# Altium schematic sheet 低频超声第四版.SchDoc
size A1
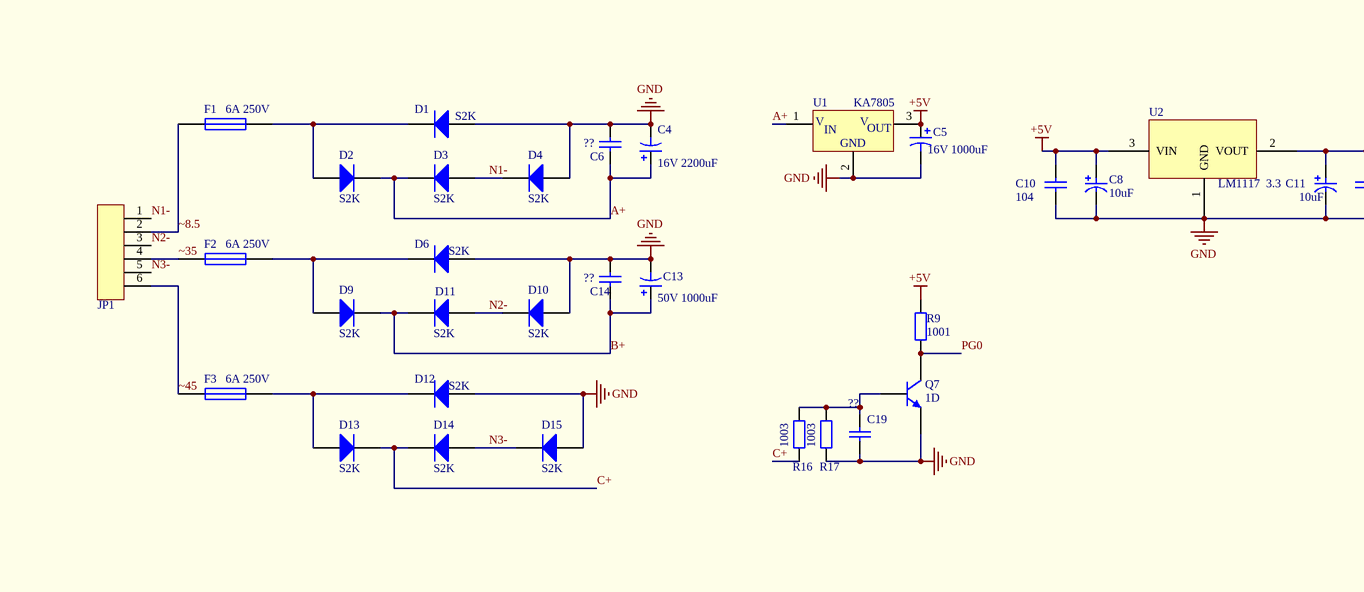
[diagram p0: 低频超声第四版.SchDoc, top left]
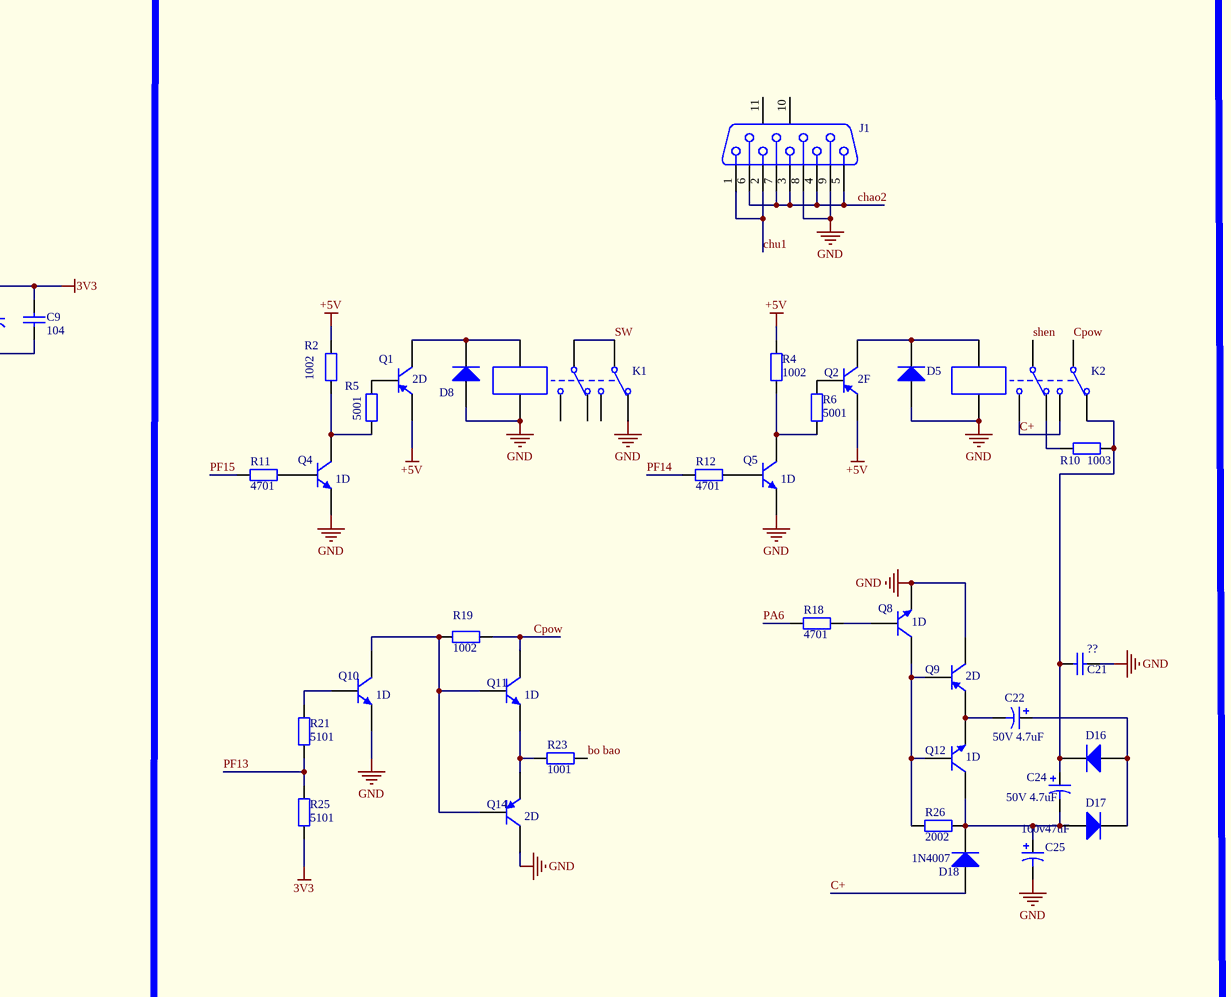
[diagram p1: 低频超声第四版.SchDoc, top middle]
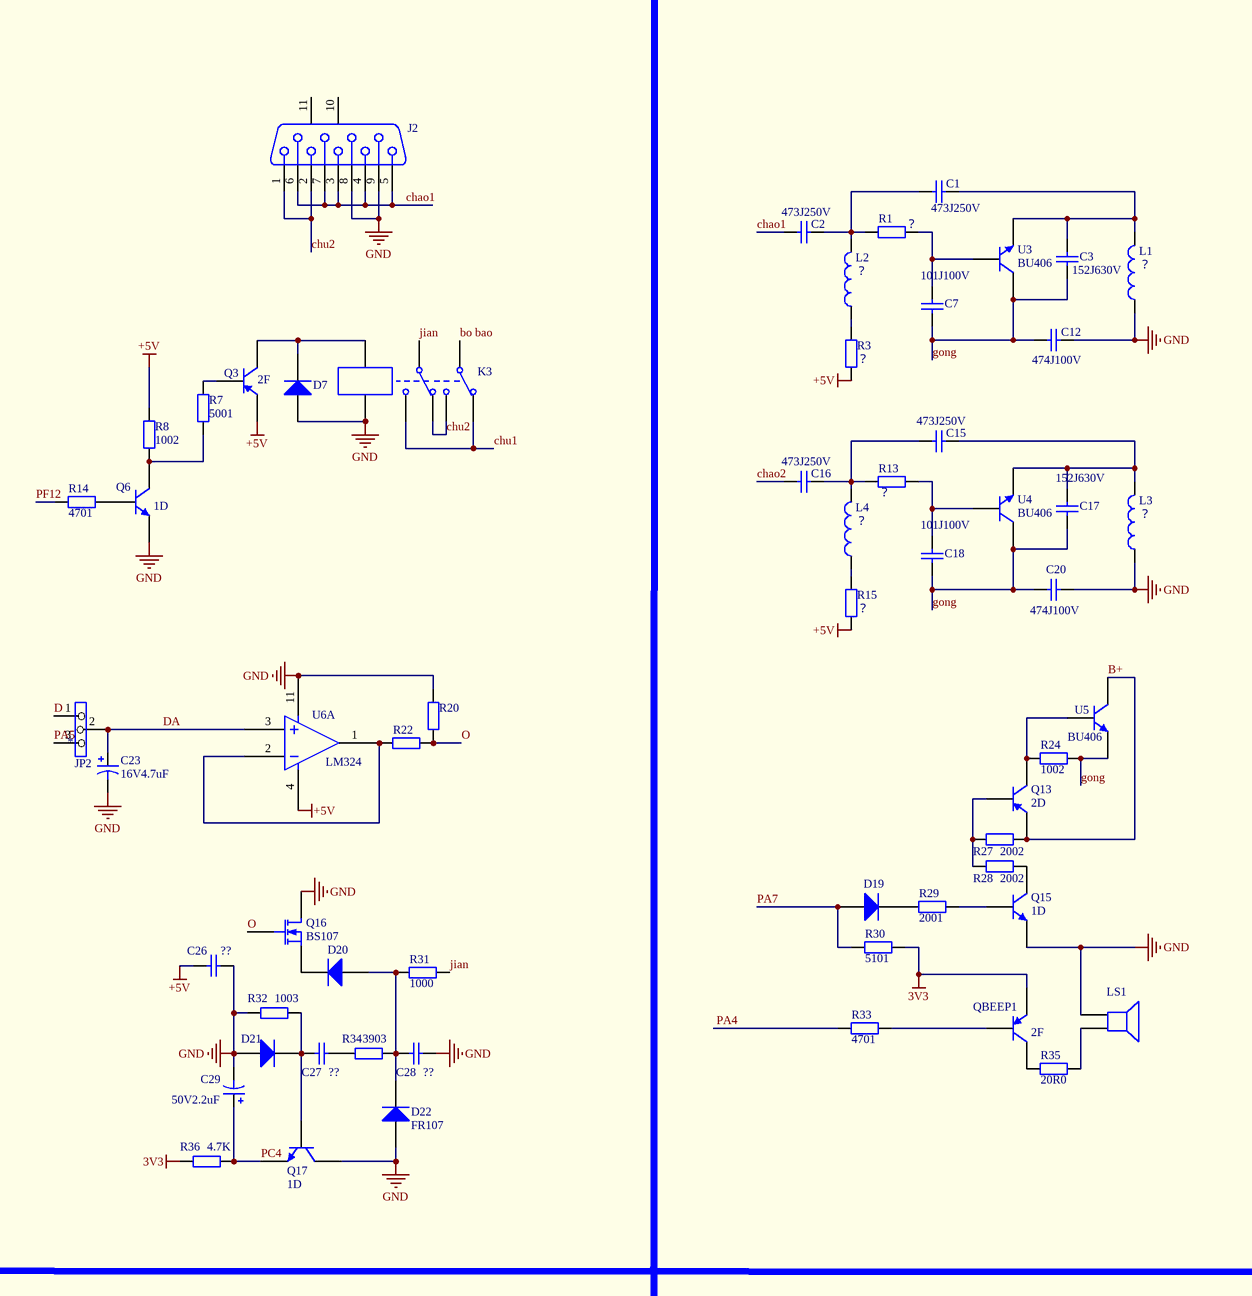
[diagram p2: 低频超声第四版.SchDoc, top right]
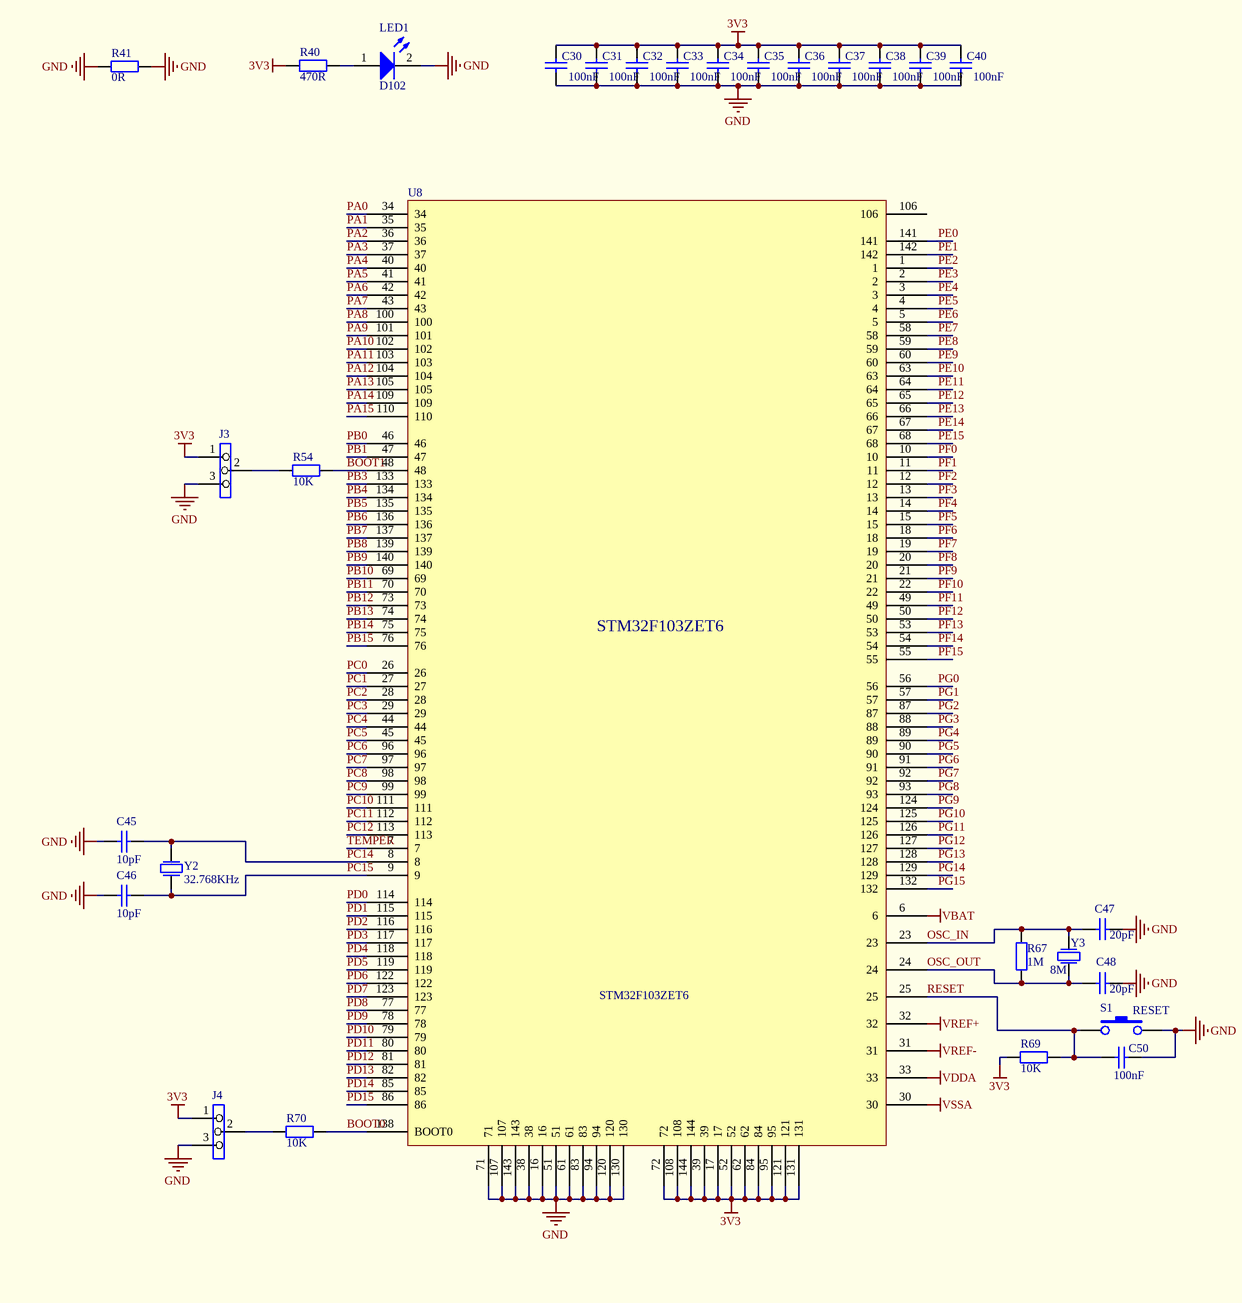
[diagram p3: 低频超声第四版.SchDoc, bottom left]
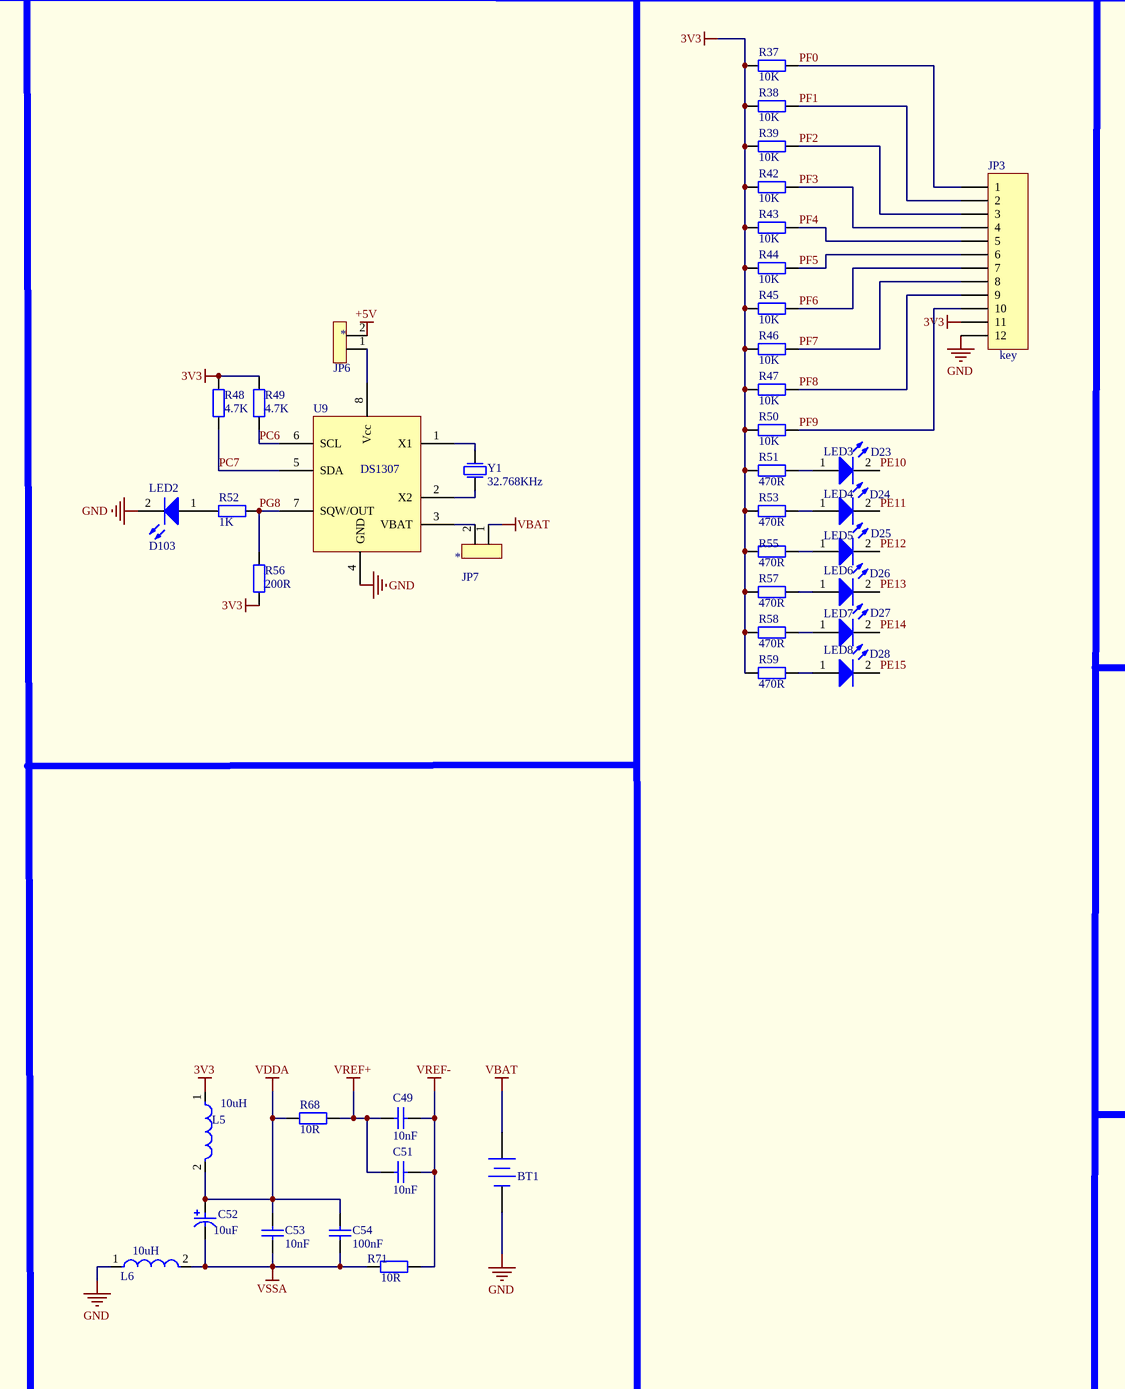
[diagram p4: 低频超声第四版.SchDoc, bottom middle]
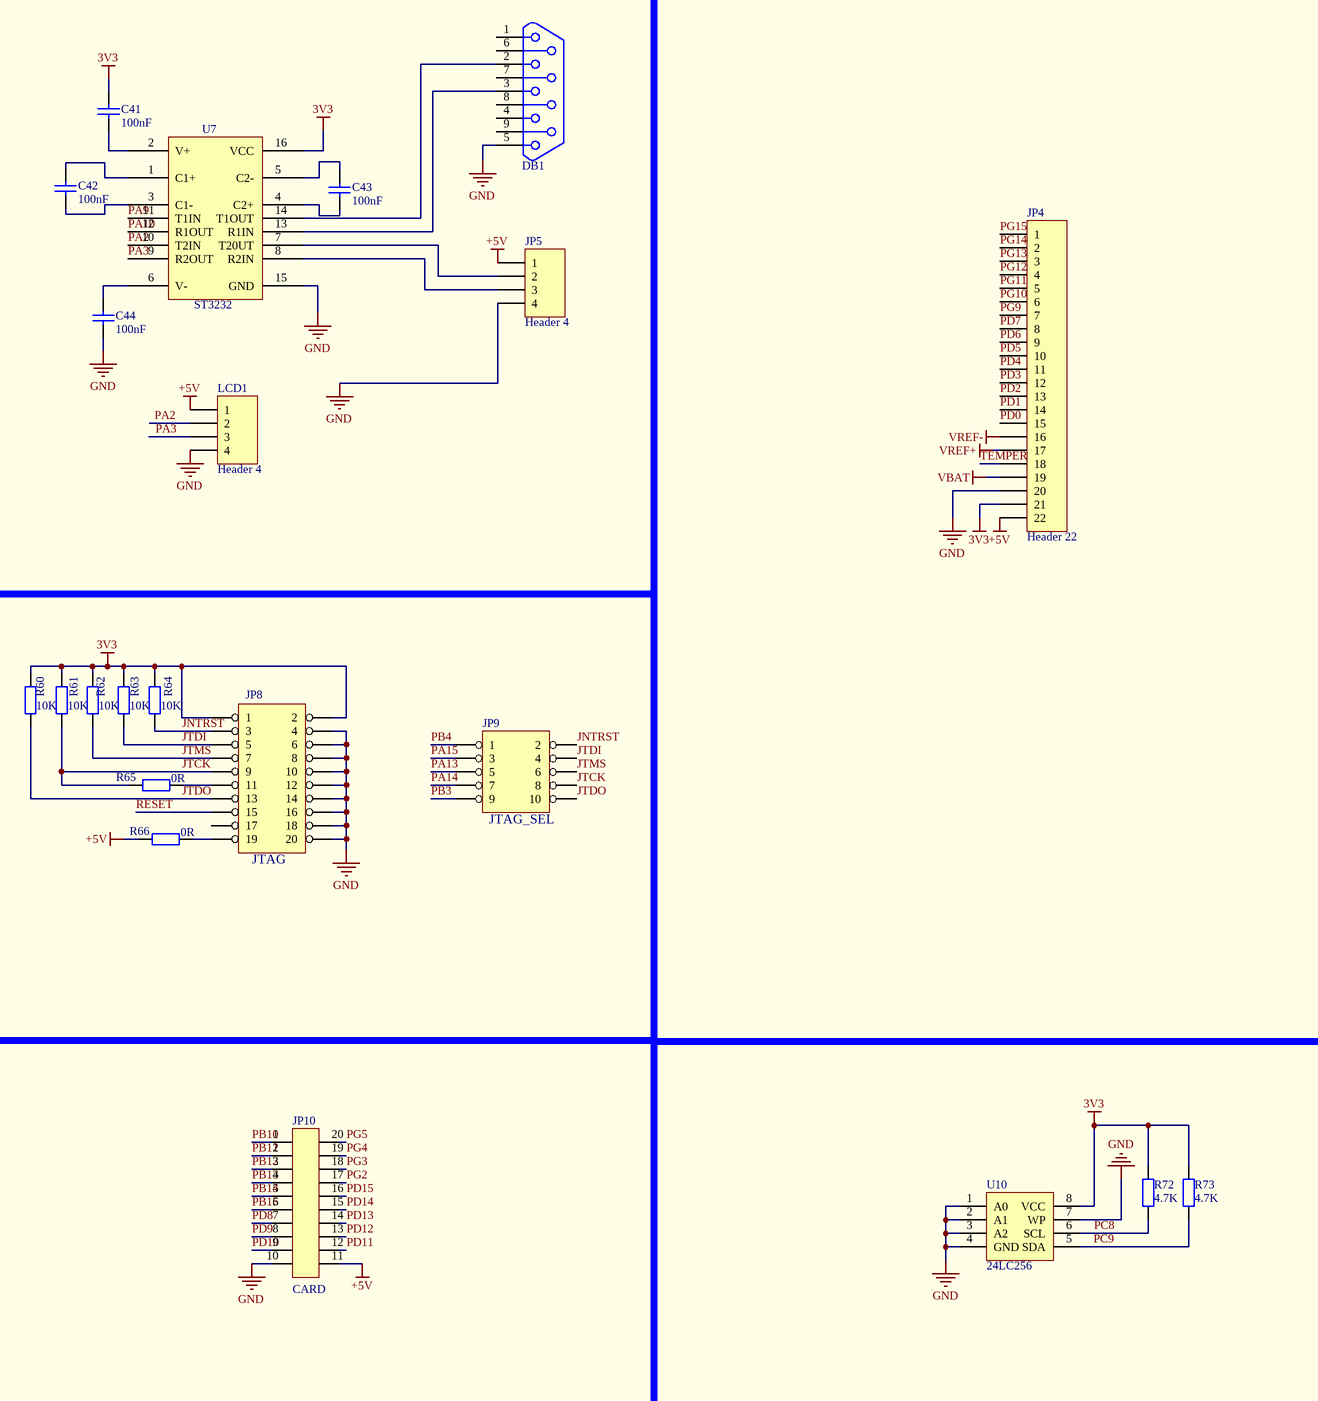
[diagram p5: 低频超声第四版.SchDoc, bottom right]

## Parts
BT1  BATTERY  [BAT]  (value not drawn)
C1  473J250V  [电容1]
C2  473J250V  [电容1]
C3  152J630V  [电容1]
C4  16V 2200uF  [钽电容1]
C5  16V 1000uF  [钽电容1]
C6  ??  [0805C]
C7  101J100V  [电容2]
C8  10uF  [钽电容1]
C9  104  [0805C]
C10  104  [0805C]
C11  10uF  [钽电容2]
C12  474J100V  [电容1]
C13  50V 1000uF  [钽电容1]
C14  ??  [0805C]
C15  473J250V  [电容1]
C16  473J250V  [电容1]
C17  152J630V  [电容1]
C18  101J100V  [电容2]
C19  ??  [0805C]
C20  474J100V  [电容1]
C21  ??  [电容2]
C22  50V 4.7uF  [钽电容1]
C23  16V4.7uF  [钽电容2]
C24  50V 4.7uF  [钽电容1]
C25  160v47uF  [钽电容2]
C26  ??  [0805C]
C27  ??  [0805C]
C28  ??  [0805C]
C29  50V2.2uF  [钽电容2]
C30  100nF  [0805C]
C31  100nF  [0805C]
C32  100nF  [0805C]
C33  100nF  [0805C]
C34  100nF  [0805C]
C35  100nF  [0805C]
C36  100nF  [0805C]
C37  100nF  [0805C]
C38  100nF  [0805C]
C39  100nF  [0805C]
C40  100nF  [0805C]
C41  100nF  [0805C]
C42  100nF  [0805C]
C43  100nF  [0805C]
C44  100nF  [0805C]
C45  10pF  [0805C]
C46  10pF  [0805C]
C47  20pF  [0805C]
C48  20pF  [0805C]
C49  10nF  [0805C]
C50  100nF  [0805C]
C51  10nF  [0805C]
C52  10uF  [钽电容2]
C53  10nF  [0805C]
C54  100nF  [0805C]
D1  S2K  [肖特基]
D2  S2K  [肖特基]
D3  S2K  [肖特基]
D4  S2K  [肖特基]
D5  Diode  [Diode]  (value not drawn)
D6  S2K  [肖特基]
D7  Diode  [Diode]  (value not drawn)
D8  Diode  [Diode]  (value not drawn)
D9  S2K  [肖特基]
D10  S2K  [肖特基]
D11  S2K  [肖特基]
D12  S2K  [肖特基]
D13  S2K  [肖特基]
D14  S2K  [肖特基]
D15  S2K  [肖特基]
D16  Diode  [Diode]  (value not drawn)
D17  Diode  [Diode]  (value not drawn)
D18  1N4007  [1N4007]
D19  Diode  [Diode]  (value not drawn)
D20  Diode  [Diode]  (value not drawn)
D21  Diode  [Diode]  (value not drawn)
D22  FR107  [1N4007]
D23  LED3  [LED]
D24  LED4  [LED]
D25  LED5  [LED]
D26  LED6  [LED]
D27  LED7  [LED]
D28  LED8  [LED]
DB1  (no value)  [串口公头]
F1  6A 250V  [保险]
F2  6A 250V  [保险]
F3  6A 250V  [保险]
J1  D Connector 9  [串口母头]  (value not drawn)
J2  D Connector 9  [串口母头]  (value not drawn)
J3  *  [选择跳线]  (value not drawn)
J4  *  [选择跳线]  (value not drawn)
JP1  6 PIN  [6 PIN]  (value not drawn)
JP2  *  [选择跳线]
JP3  key  [HDR1X12]
JP4  Header 22  [HDR1X22]
JP5  Header 4  [HDR1X4]
JP6  *  [单排插针2]
JP7  *  [单排插针2]
JP8  JTAG  [JTAG]  (value not drawn)
JP9  5*2  [5*2]  (value not drawn)
JP10  CARD  [双排插针10x2]
K1  Relay-DPDT  [DIP-P8]  (value not drawn)
K2  Relay-DPDT  [DIP-P8]  (value not drawn)
K3  Relay-DPDT  [DIP-P8]  (value not drawn)
L1  value ？  [电感]  (hidden comment: Inductor)
L2  value ？  [插阻2]  (hidden comment: Inductor)
L3  value ？  [电感]  (hidden comment: Inductor)
L4  value ？  [插阻2]  (hidden comment: Inductor)
L5  10uH  [0805R]
L6  10uH  [0805R]
LCD1  Header 4  [HDR1X4]
LED1  D102  [LED]
LED2  D103  [LED]
LS1  Speaker  [BEEP]  (value not drawn)
Q1  2D  [SOT23]
Q2  2F  [SOT23]
Q3  2F  [SOT23]
Q4  1D  [SOT23]
Q5  1D  [SOT23]
Q6  1D  [SOT23]
Q7  1D  [SOT23]
Q8  1D  [SOT23]
Q9  2D  [SOT23]
Q10  1D  [SOT23]
Q11  1D  [SOT23]
Q12  1D  [SOT23]
Q13  2D  [SOT23]
Q14  2D  [SOT23]
Q15  1D  [SOT23]
Q16  BS107  [E3]
Q17  1D  [TO-92A]
QBEEP1  2F  [SOT23]
R1  value ？  [插阻2]  (hidden comment: Res2)
R2  value 1002  [0805R]  (hidden comment: Res2)
R3  value ？  [插阻1]  (hidden comment: Res2)
R4  value 1002  [0805R]  (hidden comment: Res2)
R5  value 5001  [0805R]  (hidden comment: Res2)
R6  value 5001  [0805R]  (hidden comment: Res2)
R7  value 5001  [0805R]  (hidden comment: Res2)
R8  value 1002  [0805R]  (hidden comment: Res2)
R9  value 1001  [0805R]  (hidden comment: Res2)
R10  value 1003  [0805R]  (hidden comment: Res2)
R11  value 4701  [0805R]  (hidden comment: Res2)
R12  value 4701  [0805R]  (hidden comment: Res2)
R13  value ？  [插阻2]  (hidden comment: Res2)
R14  value 4701  [0805R]  (hidden comment: Res2)
R15  value ？  [插阻1]  (hidden comment: Res2)
R16  value 1003  [0805R]  (hidden comment: Res2)
R17  value 1003  [0805R]  (hidden comment: Res2)
R18  value 4701  [0805R]  (hidden comment: Res2)
R19  value 1002  [0805R]  (hidden comment: Res2)
R20  Res2  [0805R]  (value not drawn)
R21  value 5101  [0805R]  (hidden comment: Res2)
R22  Res2  [0805R]  (value not drawn)
R23  value 1001  [0805R]  (hidden comment: Res2)
R24  value 1002  [0805R]  (hidden comment: Res2)
R25  value 5101  [0805R]  (hidden comment: Res2)
R26  value 2002  [0805R]  (hidden comment: Res2)
R27  value 2002  [0805R]  (hidden comment: Res2)
R28  value 2002  [0805R]  (hidden comment: Res2)
R29  value 2001  [0805R]  (hidden comment: Res2)
R30  value 5101  [0805R]  (hidden comment: Res2)
R31  value 1000  [0805R]  (hidden comment: Res2)
R32  value 1003  [0805R]  (hidden comment: Res2)
R33  value 4701  [0805R]  (hidden comment: Res2)
R34  value 3903  [0805R]  (hidden comment: Res2)
R35  value 20R0  [0805R]  (hidden comment: Res2)
R36  value 4.7K  [0805R]  (hidden comment: Res2)
R37  10K  [0805R]
R38  10K  [0805R]
R39  10K  [0805R]
R40  470R  [0805R]
R41  0R  [0805R]
R42  10K  [0805R]
R43  10K  [0805R]
R44  10K  [0805R]
R45  10K  [0805R]
R46  10K  [0805R]
R47  10K  [0805R]
R48  4.7K  [0805R]
R49  4.7K  [0805R]
R50  10K  [0805R]
R51  470R  [0805R]
R52  1K  [0805R]
R53  470R  [0805R]
R54  10K  [0805R]
R55  470R  [0805R]
R56  200R  [0805R]
R57  470R  [0805R]
R58  470R  [0805R]
R59  470R  [0805R]
R60  10K  [0805R]
R61  10K  [0805R]
R62  10K  [0805R]
R63  10K  [0805R]
R64  10K  [0805R]
R65  0R  [0805R]
R66  0R  [0805R]
R67  1M  [0805R]
R68  10R  [0805R]
R69  10K  [0805R]
R70  10K  [0805R]
R71  10R  [0805R]
R72  4.7K  [0805R]
R73  4.7K  [0805R]
S1  RESET  [按键]
U1  KA7805  [7805]
U2  LM1117  3.3  [LM1117]
U3  BU406  [BU406]
U4  BU406  [BU406]
U5  BU406  [BU406]
U6  LM324  [LM324]  (part A of 4)
U7  ST3232  [ST2323]
U8  STM32F103ZET6  [STM32F103ZET6_1]
U9  DS1307  [DS1307]
U10  24LC256  [24LC256]
Y1  32.768KHz  [32.768KHz]
Y2  32.768KHz  [32.768KHz]
Y3  8M  [晶振]

## Nets
3V3: C9.2 C11.1 C30.2 C31.2 C32.2 C33.2 C34.2 C35.1 C36.1 C37.1 C38.1 C39.1 C40.1 C41.2 J3.1 J4.1 JP3.11 JP4.21 JP8.1 JP8.2 L5.1(Pri+) QBEEP1.1(E) R25.2 R30.1 R36.1 R37.2 R38.2 R39.2 R40.2 R42.2 R43.2 R44.2 R45.2 R46.2 R47.2 R48.2 R49.2 R50.2 R51.1 R53.1 R55.1 R56.2 R57.1 R58.1 R59.1 R60.1 R61.1 R62.1 R63.1 R64.1 R69.2 R72.2 R73.2 U2.2(VOUT) U7.16(VCC) U8.17 U8.39 U8.52 U8.62 U8.72 U8.84 U8.95 U8.108 U8.121 U8.131 U8.144 U10.8(VCC)
+5V: C5.1 C8.1 C10.2 C26.2 JP4.22 JP5.1 JP6.2 JP10.11 LCD1.1 Q1.1(E) Q2.1(E) Q3.1(E) R2.1 R3.1 R4.1 R8.1 R9.2 R15.1 R66.1 U1.3(VOUT) U2.3(VIN) U6.4(VCC)
GND: BT1.2(-) C4.2 C5.2 C6.1 C8.2 C9.1 C10.1 C11.2 C12.2 C13.2 C14.1 C19.1 C20.2 C21.1 C23.2 C25.2 C26.1 C28.1 C29.2 C30.1 C31.1 C32.1 C33.1 C34.1 C35.2 C36.2 C37.2 C38.2 C39.2 C40.2 C44.1 C45.2 C46.2 C47.2 C48.2 C50.2 D1.1(A) D4.1(A) D5.1(A) D6.1(A) D7.1(A) D8.1(A) D10.1(A) D12.1(A) D15.1(A) D21.1(A) D22.1(A) DB1.5 J1.8 J1.9 J2.8 J2.9 J3.3 J4.3 JP3.12 JP4.20 JP5.4 JP8.4 JP8.6 JP8.8 JP8.10 JP8.12 JP8.14 JP8.16 JP8.18 JP8.20 JP10.10 K1.1 K1.4 K2.1 K3.1 L1.1 L3.1 L6.1(Pri+) LCD1.4 LED1.2(K) LED2.2(K) LS1.1 Q4.1(E) Q5.1(E) Q6.1(E) Q7.1(E) Q8.1(E) Q9.3(C) Q10.1(E) Q14.3(C) Q15.1(E) Q16.1(D) Q17.3(C) R17.1 R20.2 R32.1 R41.1 R41.2 S1.2 U1.2(GND) U2.1(GND) U6.11(GND) U7.15(GND) U8.16 U8.38 U8.51 U8.61 U8.71 U8.83 U8.94 U8.107 U8.120 U8.130 U8.143 U9.4(GND) U10.1(A0) U10.2(A1) U10.3(A2) U10.4(GND) U10.7(WP)
VBAT: BT1.1(+) JP4.19 JP7.1 U8.6
VDDA: C52.1 C53.1 C54.1 L5.2(Pri-) R68.2 U8.33
VREF+: C49.1 C51.1 JP4.17 R68.1 U8.32
VREF-: C49.2 C51.2 JP4.16 R71.1 U8.31
VSSA: C52.2 C53.2 C54.2 L6.2(Pri-) R71.2 U8.30
A+: C4.1 C6.2 D2.2(K) D3.2(K) U1.1(VIN)
B+: C13.1 C14.2 D9.2(K) D11.2(K) Q13.1(E) R27.2 U5.3(C)
bo bao: K3.2 R23.1
BOOT0: R70.1 U8.138(BOOT0)
BOOT1: R54.1 U8.48
C+: D13.2(K) D14.2(K) D18.1(A) K2.3 K2.6 R16.1
chao1: C2.1 J2.3 J2.4 J2.5 J2.6 J2.7
chao2: C16.1 J1.3 J1.4 J1.5 J1.6 J1.7
chu1: J1.1 J1.2 K3.4 K3.6
chu2: J2.1 J2.2 K3.3 K3.5
Cpow: K2.2 Q11.3(C) R19.1
D: JP2.1
DA: C23.1 JP2.2 U6.3
gong: C3.2 C7.1 C12.1 C17.2 C18.1 C20.1 R24.1 U3.3(C) U4.3(C) U5.1(E)
jian: K3.7 R31.2
JNTRST: JP8.3 JP9.2 R64.2
JTCK: JP8.9 JP9.8 R61.2 R65.1
JTDI: JP8.5 JP9.4 R63.2
JTDO: JP8.13 JP9.10 R60.2
JTMS: JP8.7 JP9.6 R62.2
N1-: D3.1(A) D4.2(K) JP1.1
N2-: D10.2(K) D11.1(A) JP1.3
N3-: D14.1(A) D15.2(K) JP1.5
O: Q16.2(G) R20.1 R22.2
OSC_IN: C47.1 R67.2 U8.23 Y3.1(P1)
OSC_OUT: C48.1 R67.1 U8.24 Y3.2(P2)
PA0: U8.34
PA1: U8.35
PA2: LCD1.2 U7.10(T2IN) U8.36
PA3: LCD1.3 U7.9(R2OUT) U8.37
PA4: R33.2 U8.40
PA5: JP2.3 U8.41
PA6: R18.2 U8.42
PA7: D19.1(A) R30.2 U8.43
PA8: U8.100
PA9: U7.11(T1IN) U8.101
PA10: U7.12(R1OUT) U8.102
PA11: U8.103
PA12: U8.104
PA13: JP9.5 U8.105
PA14: JP9.7 U8.109
PA15: JP9.3 U8.110
PB0: U8.46
PB1: U8.47
PB3: JP9.9 U8.133
PB4: JP9.1 U8.134
PB5: U8.135
PB6: U8.136
PB7: U8.137
PB8: U8.139
PB9: U8.140
PB10: JP10.1 U8.69
PB11: JP10.2 U8.70
PB12: JP10.3 U8.73
PB13: JP10.4 U8.74
PB14: JP10.5 U8.75
PB15: JP10.6 U8.76
PC0: U8.26
PC1: U8.27
PC2: U8.28
PC3: U8.29
PC4: C29.1 Q17.1(E) R36.2 U8.44
PC5: U8.45
PC6: R49.1 U8.96 U9.6(SCL)
PC7: R48.1 U8.97 U9.5(SDA)
PC8: R72.1 U8.98 U10.6(SCL)
PC9: R73.1 U8.99 U10.5(SDA)
PC10: U8.111
PC11: U8.112
PC12: U8.113
PC14: C45.1 U8.8 Y2.2(P2)
PC15: C46.1 U8.9 Y2.1(P1)
PD0: JP4.15 U8.114
PD1: JP4.14 U8.115
PD2: JP4.13 U8.116
PD3: JP4.12 U8.117
PD4: JP4.11 U8.118
PD5: JP4.10 U8.119
PD6: JP4.9 U8.122
PD7: JP4.8 U8.123
PD8: JP10.7 U8.77
PD9: JP10.8 U8.78
PD10: JP10.9 U8.79
PD11: JP10.12 U8.80
PD12: JP10.13 U8.81
PD13: JP10.14 U8.82
PD14: JP10.15 U8.85
PD15: JP10.16 U8.86
PE0: U8.141
PE1: U8.142
PE2: U8.1
PE3: U8.2
PE4: U8.3
PE5: U8.4
PE6: U8.5
PE7: U8.58
PE8: U8.59
PE9: U8.60
PE10: D23.2(K) U8.63
PE11: D24.2(K) U8.64
PE12: D25.2(K) U8.65
PE13: D26.2(K) U8.66
PE14: D27.2(K) U8.67
PE15: D28.2(K) U8.68
PF0: JP3.1 R37.1 U8.10
PF1: JP3.2 R38.1 U8.11
PF2: JP3.3 R39.1 U8.12
PF3: JP3.4 R42.1 U8.13
PF4: JP3.5 R43.1 U8.14
PF5: JP3.6 R44.1 U8.15
PF6: JP3.7 R45.1 U8.18
PF7: JP3.8 R46.1 U8.19
PF8: JP3.9 R47.1 U8.20
PF9: JP3.10 R50.1 U8.21
PF10: U8.22
PF11: U8.49
PF12: R14.2 U8.50
PF13: R21.2 R25.1 U8.53
PF14: R12.2 U8.54
PF15: R11.2 U8.55
PG0: Q7.3(C) R9.1 U8.56
PG1: U8.57
PG2: JP10.17 U8.87
PG3: JP10.18 U8.88
PG4: JP10.19 U8.89
PG5: JP10.20 U8.90
PG6: U8.91
PG7: U8.92
PG8: R52.1 R56.1 U8.93 U9.7(SQW/OUT)
PG9: JP4.7 U8.124
PG10: JP4.6 U8.125
PG11: JP4.5 U8.126
PG12: JP4.4 U8.127
PG13: JP4.3 U8.128
PG14: JP4.2 U8.129
PG15: JP4.1 U8.132
RESET: C50.1 JP8.15 R69.1 S1.1 U8.25
shen: K2.7
SW: K1.2 K1.7
TEMPER: JP4.18 U8.7
~8.5: F1.1 JP1.2
~35: F2.1 JP1.4
~45: F3.1 JP1.6
NetC1_1: C1.1 C2.2 L2.2 R1.2
NetC1_2: C1.2 C3.1 L1.2 U3.1(E)
NetC7_2: C7.2 R1.1 U3.2(B)
NetC15_1: C15.1 C16.2 L4.2 R13.2
NetC15_2: C15.2 C17.1 L3.2 U4.1(E)
NetC18_2: C18.2 R13.1 U4.2(B)
NetC19_2: C19.2 Q7.2(B) R16.2 R17.2
NetC21_2: C21.2 C24.1 D16.2(K) K2.4 R10.1
NetC22_1: C22.1 D16.1(A) D17.2(K)
NetC22_2: C22.2 Q9.1(E) Q12.1(E)
NetC24_2: C24.2 C25.1 D17.1(A) D18.2(K) Q12.3(C) R26.2
NetC27_1: C27.1 R34.1
NetC27_2: C27.2 D21.2(K) Q17.2(B) R32.2
NetC28_2: C28.2 D20.1(A) D22.2(K) R31.1 R34.2
NetC41_1: C41.1 U7.2(V+)
NetC42_1: C42.1 U7.3(C1-)
NetC42_2: C42.2 U7.1(C1+)
NetC43_1: C43.1 U7.4(C2+)
NetC43_2: C43.2 U7.5(C2-)
NetC44_2: C44.2 U7.6(V-)
NetD1_2: D1.2(K) D2.1(A) F1.2
NetD5_2: D5.2(K) K2.8 Q2.3(C)
NetD6_2: D6.2(K) D9.1(A) F2.2
NetD7_2: D7.2(K) K3.8 Q3.3(C)
NetD8_2: D8.2(K) K1.8 Q1.3(C)
NetD12_2: D12.2(K) D13.1(A) F3.2
NetD19_2: D19.2(K) R29.2
NetD20_2: D20.2(K) Q16.3(S)
NetD23_1: D23.1(A) R51.2
NetD24_1: D24.1(A) R53.2
NetD25_1: D25.1(A) R55.2
NetD26_1: D26.1(A) R57.2
NetD27_1: D27.1(A) R58.2
NetD28_1: D28.1(A) R59.2
NetDB1_2: DB1.2 U7.14(T1OUT)
NetDB1_3: DB1.3 U7.13(R1IN)
NetJ3_2: J3.2 R54.2
NetJ4_2: J4.2 R70.2
NetJP5_2: JP5.2 U7.7(T20UT)
NetJP5_3: JP5.3 U7.8(R2IN)
NetJP6_1: JP6.1 U9.8(Vcc)
NetJP7_2: JP7.2 U9.3(VBAT)
NetJP8_11: JP8.11 R65.2
NetJP8_19: JP8.19 R66.2
NetK2_5: K2.5 R10.2
NetL2_1: L2.1 R3.2
NetL4_1: L4.1 R15.2
NetLED1_1: LED1.1(A) R40.1
NetLED2_1: LED2.1(A) R52.2
NetLS1_2: LS1.2 R35.1
NetQ1_2: Q1.2(B) R5.1
NetQ2_2: Q2.2(B) R6.1
NetQ3_2: Q3.2(B) R7.1
NetQ4_2: Q4.2(B) R11.1
NetQ4_3: Q4.3(C) R2.2 R5.2
NetQ5_2: Q5.2(B) R12.1
NetQ5_3: Q5.3(C) R4.2 R6.2
NetQ6_2: Q6.2(B) R14.1
NetQ6_3: Q6.3(C) R7.2 R8.2
NetQ8_2: Q8.2(B) R18.1
NetQ8_3: Q8.3(C) Q9.2(B) Q12.2(B) R26.1
NetQ10_2: Q10.2(B) R21.1
NetQ10_3: Q10.3(C) Q11.2(B) Q14.2(B) R19.2
NetQ11_1: Q11.1(E) Q14.1(E) R23.2
NetQ13_2: Q13.2(B) R27.1 R28.1
NetQ13_3: Q13.3(C) R24.2 U5.2(B)
NetQ15_2: Q15.2(B) R29.1
NetQ15_3: Q15.3(C) R28.2
NetQBEEP1_2: QBEEP1.2(B) R33.1
NetQBEEP1_3: QBEEP1.3(C) R35.2
NetR22_1: R22.1 U6.1 U6.2
NetU9_1: U9.1(X1) Y1.2(P2)
NetU9_2: U9.2(X2) Y1.1(P1)

Not connected (* = marked no-connect by the designer): DB1 1 4 6 7 8 9; J1 10(MH1) 11(MH2); J2 10(MH1) 11(MH2); JP8 17; K1 3 5 6; U8 106

## Notes on the sheet
- (in symbol 5*2) JTAG_SEL
- (in symbol 78L) V; IN; OUT

## Library data of the parts
C1-C3 C7 C12 C15-C21 C26-C28 = Cap: Capacitor; Published: 8-Jun-2000; LatestRevisionDate: 17-Jul-2002; LatestRevisionNote: Re-released for DXP Platform.; PackageReference: RAD-0.3; Publisher: Altium Limited; PackageDescription: Radial Cap, Thru-Hole; 2 Leads; 0.3 in Pin Spacing
  C1 C2 C15 C16: Value: 473J250V
  C3 C17: Value: 152J630V
  C7 C18: Value: 101J100V
  C12 C20: Value: 474J100V
  C19: Value: ??
  C21 C26-C28: Value: ?
C4 C5 C13 C22 = Cap Pol1: Polarized Capacitor (Radial); Value: 100pF; Published: 8-Jun-2000; LatestRevisionDate: 17-Jul-2002; LatestRevisionNote: Re-released for DXP Platform.; PackageReference: RB7.6-15; Publisher: Altium Limited; PackageDescription: Polarized Capacitor (Radial); 2 Leads
C6 C14 = Cap: Capacitor; Value: 100pF; Published: 8-Jun-2000; LatestRevisionDate: 17-Jul-2002; LatestRevisionNote: Re-released for DXP Platform.; PackageReference: RAD-0.3; Publisher: Altium Limited; PackageDescription: Radial Cap, Thru-Hole; 2 Leads; 0.3 in Pin Spacing
C8 C11 C52 = 钽电容
C9 C10 C30-C51 C53 C54 = 电容
C23 = Cap Pol1: Polarized Capacitor (Radial); Value: 50V2.2uF; Published: 8-Jun-2000; LatestRevisionDate: 17-Jul-2002; LatestRevisionNote: Re-released for DXP Platform.; PackageReference: RB7.6-15; Publisher: Altium Limited; PackageDescription: Polarized Capacitor (Radial); 2 Leads
C24 C25 C29 = Cap Pol1: Polarized Capacitor (Radial); Published: 8-Jun-2000; LatestRevisionDate: 17-Jul-2002; LatestRevisionNote: Re-released for DXP Platform.; PackageReference: RB7.6-15; Publisher: Altium Limited; PackageDescription: Polarized Capacitor (Radial); 2 Leads
  C24: Value: 50V4.7uF
  C25: Value: 160v47uF
  C29: Value: 50V2.2uF
D1-D22 = Diode: Default Diode; Published: 8-Jun-2000; LatestRevisionDate: 17-Jul-2002; LatestRevisionNote: Re-released for DXP Platform.; PackageVersion: Sep-1996; PackageReference: SMC; Publisher: Altium Limited; PackageDescription: DO-214-AB/SMC; 2 C-Bend Leads; Body 7.9 x 5.9 mm, inc. leads (LxW); Code_JEDEC: DO-214-AB
D23-D28 LED1 LED2 = LED
DB1 = DB
F1-F3 = Fuse 1: Fuse; Published: 8-Jun-2000; LatestRevisionDate: 17-Jul-2002; LatestRevisionNote: Re-released for DXP Platform.; PackageReference: PIN-W2/E2.8; Publisher: Altium Limited; PackageDescription: Thru-Hole; 2 Leads
J1 J2 = D Connector 9: Receptacle Assembly, 9 Position, Right Angle; PackageDocument: O; Positions: 9; Published: 15-Jun-2001; LatestRevisionDate: 17-Jul-2002; LatestRevisionNote: Re-released for DXP Platform.; DatasheetDocument: 1-Sep-1999; PackageReference: 788750; Publisher: Altium Limited; Orientation: Right Angle; Gender: Receptacle
J3 J4 JP2 = 选择跳线
JP3 = Header 12: Header, 12-Pin; LatestRevisionDate: 17-Jul-2002; LatestRevisionNote: Re-released for DXP Platform.; Publisher: Altium Limited
JP4 = Header 22: Header, 22-Pin; LatestRevisionDate: 17-Jul-2002; LatestRevisionNote: Re-released for DXP Platform.; Publisher: Altium Limited
JP5 LCD1 = Header 4: Header, 4-Pin; LatestRevisionDate: 17-Jul-2002; LatestRevisionNote: Re-released for DXP Platform.; Publisher: Altium Limited
JP6 JP7 = 单排插针2
JP10 = ?
K1-K3 = Relay-DPDT: Dual-Pole Dual-Throw Relay; Published: 24-Mar-1999; LatestRevisionDate: 17-Jul-2002; LatestRevisionNote: Re-released for DXP Platform.; PackageReference: DIP-P8; Publisher: Altium Limited; PackageDescription: Relay; 8 Leads
L1-L4 = Inductor: Code_IEC: 1005; Published: 8-Jun-2000; LatestRevisionDate: 29-May-2009; LatestRevisionNote: IPC-7351 Footprint Added.; PackageReference: 0402-A; Publisher: Altium Limited; PackageDescription: Chip Inductor; Code_JEITA: 0402
L5 L6 = 电感
LS1 = Speaker: Loudspeaker; Published: 24-Mar-1999; LatestRevisionDate: 17-Jul-2002; LatestRevisionNote: Re-released for DXP Platform.; PackageReference: PIN2; Publisher: Altium Limited
Q1-Q3 Q9 Q13 Q14 QBEEP1 = 2N3906: PNP General Purpose Amplifier; Published: 8-Jun-2000; LatestRevisionDate: 15-Jan-2003; LatestRevisionNote: PCB Footprint 'BCY-W3/D4.7' replaced; DatasheetVersion: 1997; PackageVersion: Sep-1998; PackageReference: TO-92A; Publisher: Altium Limited; PackageDescription: TO, Flat Index; 3 In-Line, Axial Leads; Body Dia. 4.5mm; Leads 0.51 x 0.48 mm (max); ComponentLink1Description: Manufacturer Link; ComponentLink1URL: http://www.fairchildsemi.com/; ComponentLink2Description: Datasheet; ComponentLink2URL: http://www.fairchildsemi.com/ds/2N%2F2N3906.pdf
Q4-Q8 Q10-Q12 Q15 Q17 U3-U5 = 2N3904: NPN General Purpose Amplifier; Published: 8-Jun-2000; LatestRevisionDate: 15-Jan-2003; LatestRevisionNote: PCB Footprint 'BCY-W3/D4.7' replaced; DatasheetVersion: 1997; PackageVersion: Sep-1998; PackageReference: TO-92A; Publisher: Altium Limited; PackageDescription: TO, Flat Index; 3 In-Line, Axial Leads; Body Dia. 4.5mm; Leads 0.51 x 0.48 mm (max); ComponentLink1Description: Manufacturer Link; ComponentLink1URL: http://www.fairchildsemi.com/; ComponentLink2Description: Datasheet; ComponentLink2URL: http://www.fairchildsemi.com/ds/2N%2F2N3904.pdf
Q16 = MOSFET-N: N-Channel MOSFET; Published: 8-Jun-2000; LatestRevisionDate: 17-Jul-2002; LatestRevisionNote: Re-released for DXP Platform.; PackageVersion: 1995/1996; PackageReference: E3; Publisher: Altium Limited; PackageDescription: TO, Flat Index; 3 In-Line, Axial Leads; Body Dia. 4.6mm; Lead Dia. 0.5 mm (max)
R1-R36 = Res2: Resistor; Published: 8-Jun-2000; LatestRevisionDate: 17-Jul-2002; LatestRevisionNote: Re-released for DXP Platform.; PackageReference: AXIAL-0.4; Publisher: Altium Limited; PackageDescription: Axial Device, Thru-Hole; 2 Leads; 0.4 in Pin Spacing
R37-R73 = 电阻
S1 = 按键
U1 = 78L: 3-Terminal Positive Voltage Regulator
U2 = 1117
U6 = LM3
U7 U8 = ST
U9 = DS1
U10 = 24
Y1 Y2 = 32.768KH
Y3 = 晶振